# Altium schematic sheet IMU.SchDoc
size A4
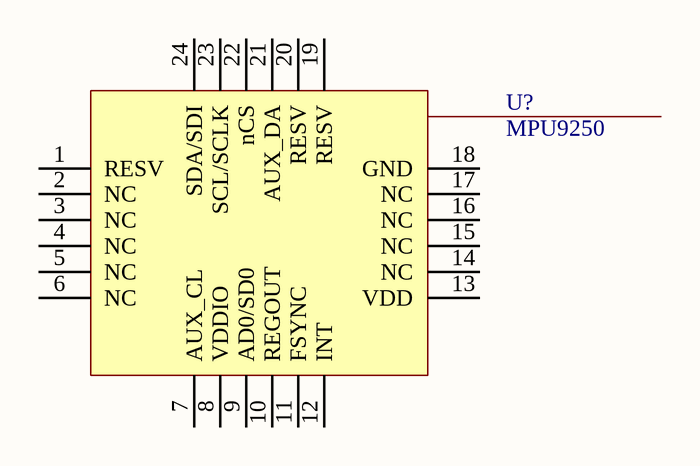
[diagram p0: IMU.SchDoc]

## Parts
U?  MPU9250  [QFN40P300X300X105_HS-25L]

## Nets

Not connected (* = marked no-connect by the designer): U? 1(RESV) 2(NC) 3(NC) 4(NC) 5(NC) 6(NC) 7(AUX_CL) 8(VDDIO) 9(AD0/SD0) 10(REGOUT) 11(FSYNC) 12(INT) 13(VDD) 14(NC) 15(NC) 16(NC) 17(NC) 18(GND) 19(RESV) 20(RESV) 21(AUX_DA) 22(nCS) 23(SCL/SCLK) 24(SDA/SDI)